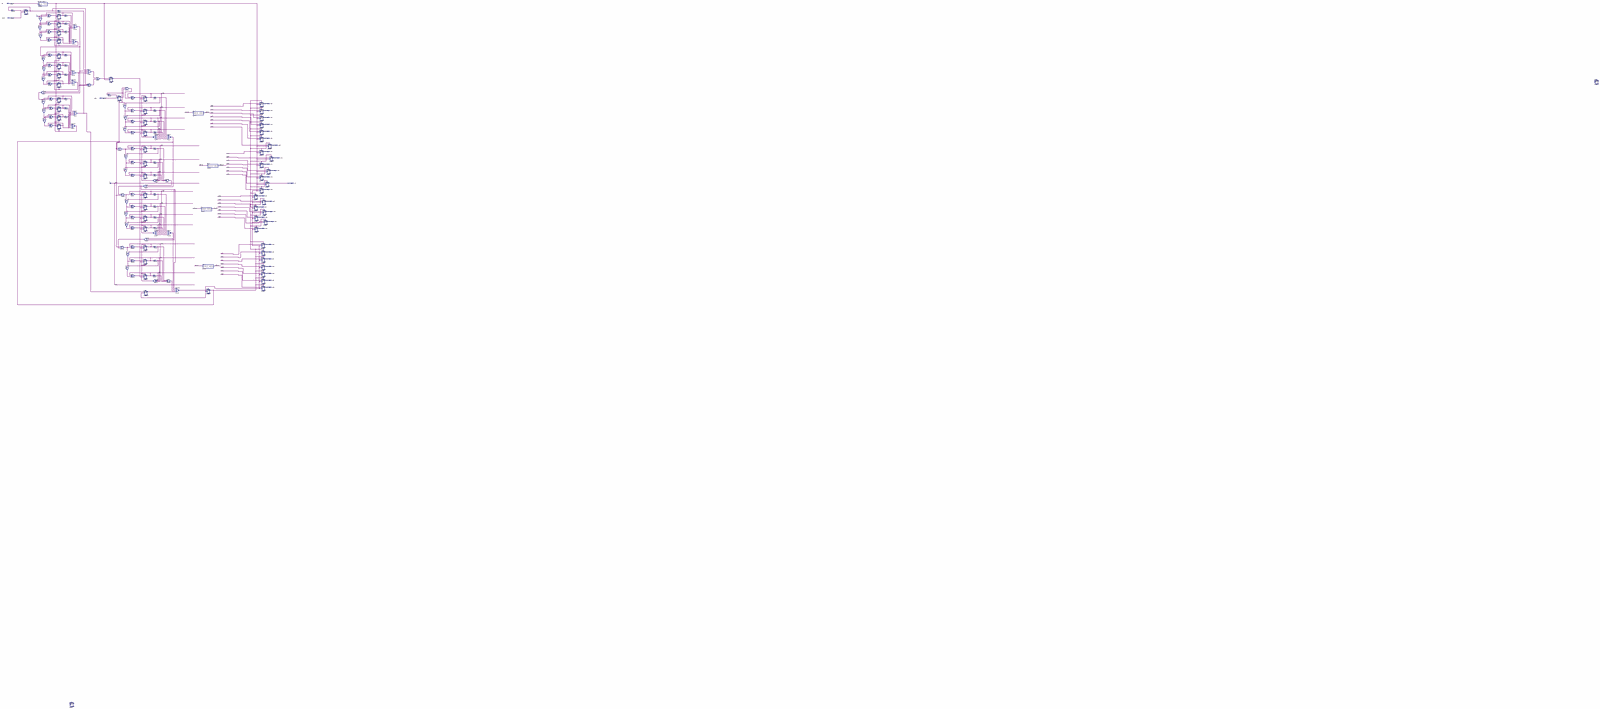
[diagram p0: schematic sheet, whole]
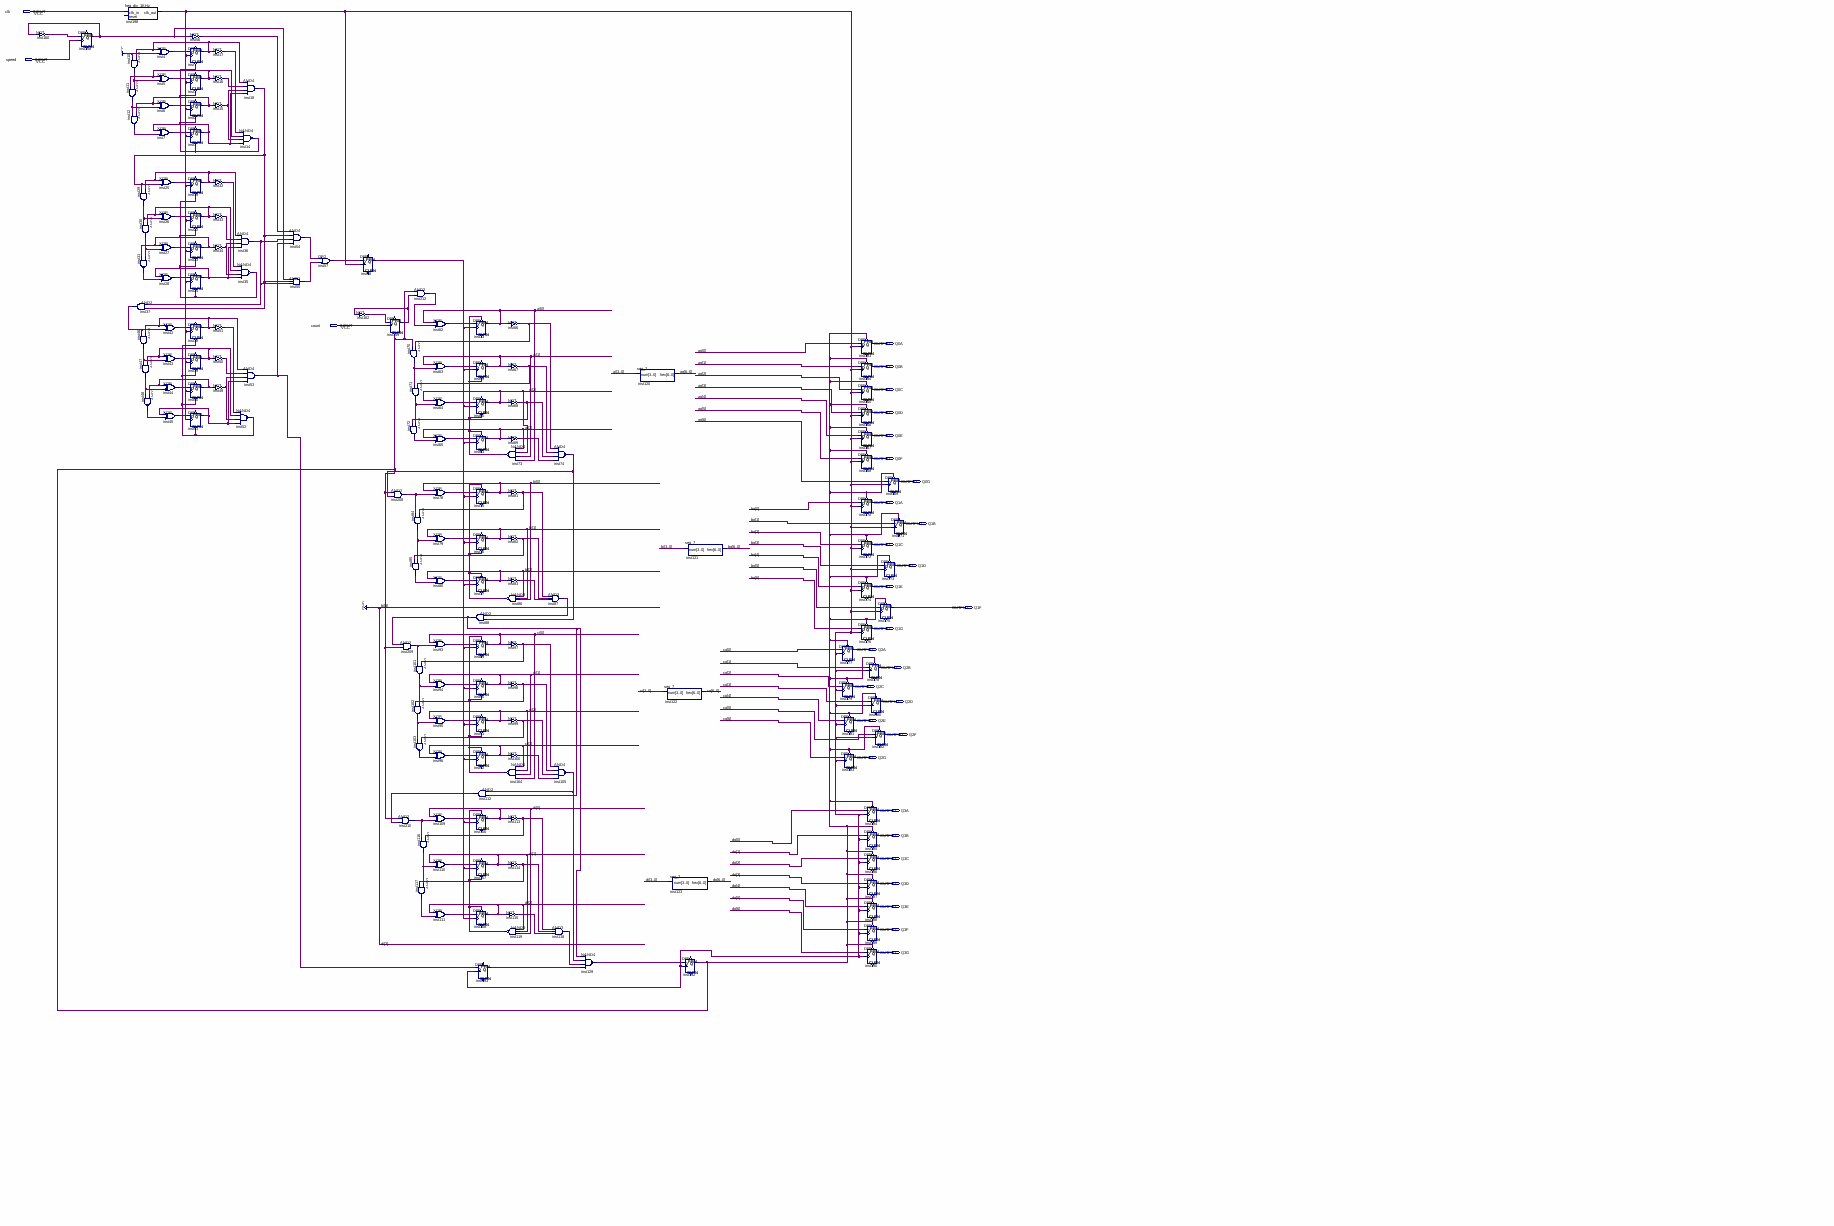
[diagram p1: schematic sheet, upper left part]
// Quartus schematic midterm.bdf as structural Verilog: 162 symbols, 31 pins
module midterm (
  input  clk,
  input  speed,
  input  count,
  output Q0A,
  output Q0B,
  output Q0C,
  output Q0D,
  output Q0E,
  output Q0F,
  output Q0G,
  output Q1A,
  output Q1B,
  output Q1C,
  output Q1D,
  output Q1E,
  output Q1F,
  output Q1G,
  output Q2A,
  output Q2B,
  output Q2C,
  output Q2D,
  output Q2E,
  output Q2F,
  output Q2G,
  output Q3A,
  output Q3B,
  output Q3C,
  output Q3D,
  output Q3E,
  output Q3F,
  output Q3G
);

  wire inst1_q, inst2_q, inst3_q, inst4_out, inst5_out, inst6_out, inst7_out, inst10_out, inst11_out,
       inst12_out, inst14_out, inst15_out, inst16_out, inst17_out, inst18_out, inst19_q, inst22_q, inst23_q,
       inst24_q, inst25_out, inst26_out, inst27_out, inst28_out, inst29_out, inst30_out, inst31_out,
       inst32_out, inst33_out, inst34_out, inst35_out, inst36_out, inst37_out, inst38_q, inst39_q, inst40_q,
       inst41_q, inst42_out, inst43_out, inst44_out, inst45_out, inst46_out, inst47_out, inst48_out,
       inst49_out, inst50_out, inst51_out, inst52_out, inst53_out, inst54_out, inst55_out, inst56_out,
       inst57_out, inst58_q, inst62_out, inst63_out, inst64_out, inst65_out, inst66_out, inst67_out,
       inst68_out, inst69_out, inst70_out, inst71_out, inst72_out, inst73_out, inst74_out, inst78_out,
       inst79_out, inst80_out, inst81_out, inst82_out, inst83_out, inst84_out, inst85_out, inst86_out,
       inst87_out, inst88_out, inst93_out, inst94_out, inst95_out, inst96_out, inst97_out, inst98_out,
       inst99_out, inst100_out, inst101_out, inst102_out, inst103_out, inst104_out, inst105_out, inst109_out,
       inst110_out, inst111_out, inst112_out, inst113_out, inst114_out, inst115_out, inst116_out,
       inst117_out, inst118_out, inst119_out, inst129_out, inst158_q, inst159_q, inst160_out, inst162_out,
       inst192_q, inst193_q, inst198_clk_out, inst208_out, inst209_out, inst210_out, inst212_out, inst_q;
  wire [2:0] bi, di;
  wire [3:0] ai, ci;
  wire [6:0] ao, bo, co, \do ;

  not inst160 (inst160_out, inst158_q);
  DFF inst158 (.CLK(speed), .D(inst160_out), .Q(inst158_q));  // open: CLRN, PRN
  freq_div_1KHz inst198 (.clk_in(clk), .clk_out(inst198_clk_out));  // open: reset
  and inst10 (inst10_out, inst_q, 1'b1);
  and inst11 (inst11_out, inst10_out, inst1_q);
  and inst12 (inst12_out, inst2_q, inst11_out);
  and inst29 (inst29_out, inst19_q, inst18_out);
  and inst31 (inst31_out, inst30_out, inst23_q);
  and inst37 (inst37_out, inst36_out, inst18_out);
  and inst46 (inst46_out, inst38_q, inst37_out);
  and inst30 (inst30_out, inst22_q, inst29_out);
  and inst47 (inst47_out, inst39_q, inst46_out);
  and inst48 (inst48_out, inst40_q, inst47_out);
  xor inst4 (inst4_out, inst_q, 1'b1);
  xor inst5 (inst5_out, inst1_q, inst10_out);
  xor inst6 (inst6_out, inst2_q, inst11_out);
  xor inst7 (inst7_out, inst3_q, inst12_out);
  xor inst25 (inst25_out, inst19_q, inst18_out);
  xor inst26 (inst26_out, inst22_q, inst29_out);
  xor inst27 (inst27_out, inst23_q, inst30_out);
  xor inst28 (inst28_out, inst24_q, inst31_out);
  xor inst42 (inst42_out, inst38_q, inst37_out);
  xor inst43 (inst43_out, inst39_q, inst46_out);
  xor inst44 (inst44_out, inst40_q, inst47_out);
  xor inst45 (inst45_out, inst41_q, inst48_out);
  not inst56 (inst56_out, inst158_q);
  DFF inst (.CLRN(inst14_out), .CLK(inst198_clk_out), .D(inst4_out), .Q(inst_q));  // open: PRN
  DFF inst1 (.CLRN(inst14_out), .CLK(inst198_clk_out), .D(inst5_out), .Q(inst1_q));  // open: PRN
  DFF inst2 (.CLRN(inst14_out), .CLK(inst198_clk_out), .D(inst6_out), .Q(inst2_q));  // open: PRN
  DFF inst3 (.CLRN(inst14_out), .CLK(inst198_clk_out), .D(inst7_out), .Q(inst3_q));  // open: PRN
  DFF inst19 (.CLRN(inst35_out), .CLK(inst198_clk_out), .D(inst25_out), .Q(inst19_q));  // open: PRN
  DFF inst22 (.CLRN(inst35_out), .CLK(inst198_clk_out), .D(inst26_out), .Q(inst22_q));  // open: PRN
  DFF inst23 (.CLRN(inst35_out), .CLK(inst198_clk_out), .D(inst27_out), .Q(inst23_q));  // open: PRN
  DFF inst24 (.CLRN(inst35_out), .CLK(inst198_clk_out), .D(inst28_out), .Q(inst24_q));  // open: PRN
  DFF inst38 (.CLRN(inst52_out), .CLK(inst198_clk_out), .D(inst42_out), .Q(inst38_q));  // open: PRN
  DFF inst39 (.CLRN(inst52_out), .CLK(inst198_clk_out), .D(inst43_out), .Q(inst39_q));  // open: PRN
  DFF inst40 (.CLRN(inst52_out), .CLK(inst198_clk_out), .D(inst44_out), .Q(inst40_q));  // open: PRN
  DFF inst41 (.CLRN(inst52_out), .CLK(inst198_clk_out), .D(inst45_out), .Q(inst41_q));  // open: PRN
  not inst17 (inst17_out, inst_q);
  not inst16 (inst16_out, inst1_q);
  not inst15 (inst15_out, inst2_q);
  not inst32 (inst32_out, inst19_q);
  not inst33 (inst33_out, inst22_q);
  not inst34 (inst34_out, inst23_q);
  not inst51 (inst51_out, inst38_q);
  not inst50 (inst50_out, inst39_q);
  not inst49 (inst49_out, inst40_q);
  DFF inst20 ();  // open: CLRN, CLK, D, PRN, Q
  and inst18 (inst18_out, inst_q, inst16_out, inst15_out, inst3_q);
  nand inst14 (inst14_out, inst17_out, inst1_q, inst15_out, inst3_q);
  and inst36 (inst36_out, inst19_q, inst33_out, inst34_out, inst24_q);
  nand inst35 (inst35_out, inst32_out, inst22_q, inst34_out, inst24_q);
  and inst53 (inst53_out, inst38_q, inst50_out, inst49_out, inst41_q);
  nand inst52 (inst52_out, inst51_out, inst39_q, inst49_out, inst41_q);
  and inst54 (inst54_out, inst56_out, inst18_out, inst36_out, inst53_out);
  and inst55 (inst55_out, inst158_q, inst18_out, inst36_out);
  or inst57 (inst57_out, inst54_out, inst55_out);
  DFF inst58 (.CLK(inst198_clk_out), .D(inst57_out), .Q(inst58_q));  // open: CLRN, PRN
  not inst162 (inst162_out, inst159_q);
  DFF inst159 (.CLRN(inst192_q), .CLK(count), .D(inst162_out), .Q(inst159_q));  // open: PRN
  and inst208 (inst208_out, inst192_q, inst74_out);
  and inst210 (inst210_out, inst192_q, inst112_out);
  and inst212 (inst212_out, inst192_q, inst159_q);
  and inst70 (inst70_out, inst66_out, inst192_q);
  and inst71 (inst71_out, inst67_out, inst70_out);
  and inst72 (inst72_out, inst71_out, inst68_out);
  and inst84 (inst84_out, inst81_out, inst208_out);
  and inst85 (inst85_out, inst84_out, inst82_out);
  and inst209 (inst209_out, inst88_out, inst192_q);
  and inst101 (inst101_out, inst97_out, inst209_out);
  and inst102 (inst102_out, inst101_out, inst98_out);
  and inst103 (inst103_out, inst99_out, inst102_out);
  and inst116 (inst116_out, inst113_out, inst210_out);
  and inst117 (inst117_out, inst116_out, inst114_out);
  xor inst62 (inst62_out, ai[0], inst212_out);
  xor inst63 (inst63_out, ai[1], inst70_out);
  xor inst64 (inst64_out, ai[2], inst71_out);
  xor inst65 (inst65_out, ai[3], inst72_out);
  xor inst78 (inst78_out, bi[0], inst208_out);
  xor inst79 (inst79_out, bi[1], inst84_out);
  xor inst80 (inst80_out, bi[2], inst85_out);
  xor inst93 (inst93_out, ci[0], inst209_out);
  xor inst94 (inst94_out, ci[1], inst101_out);
  xor inst95 (inst95_out, ci[2], inst102_out);
  xor inst96 (inst96_out, ci[3], inst103_out);
  xor inst109 (inst109_out, di[0], inst210_out);
  xor inst110 (inst110_out, di[1], inst116_out);
  xor inst111 (inst111_out, di[2], inst117_out);
  DFF inst13 (.CLK(inst58_q), .D(inst62_out), .PRN(inst73_out), .Q(ai[0]));  // open: CLRN
  DFF inst59 (.CLRN(inst73_out), .CLK(inst58_q), .D(inst63_out), .Q(ai[1]));  // open: PRN
  DFF inst60 (.CLRN(inst73_out), .CLK(inst58_q), .D(inst64_out), .Q(ai[2]));  // open: PRN
  DFF inst61 (.CLK(inst58_q), .D(inst65_out), .PRN(inst73_out), .Q(ai[3]));  // open: CLRN
  DFF inst75 (.CLK(inst58_q), .D(inst78_out), .PRN(inst86_out), .Q(bi[0]));  // open: CLRN
  DFF inst76 (.CLRN(inst86_out), .CLK(inst58_q), .D(inst79_out), .Q(bi[1]));  // open: PRN
  DFF inst77 (.CLK(inst58_q), .D(inst80_out), .PRN(inst86_out), .Q(bi[2]));  // open: CLRN
  and inst88 (inst88_out, inst87_out, inst74_out);
  DFF inst89 (.CLK(inst58_q), .D(inst93_out), .PRN(inst104_out), .Q(ci[0]));  // open: CLRN
  DFF inst90 (.CLRN(inst104_out), .CLK(inst58_q), .D(inst94_out), .Q(ci[1]));  // open: PRN
  DFF inst91 (.CLRN(inst104_out), .CLK(inst58_q), .D(inst95_out), .Q(ci[2]));  // open: PRN
  DFF inst92 (.CLK(inst58_q), .D(inst96_out), .PRN(inst104_out), .Q(ci[3]));  // open: CLRN
  and inst112 (inst112_out, inst105_out, inst88_out);
  DFF inst106 (.CLK(inst58_q), .D(inst109_out), .PRN(inst119_out), .Q(di[0]));  // open: CLRN
  DFF inst107 (.CLRN(inst119_out), .CLK(inst58_q), .D(inst110_out), .Q(di[1]));  // open: PRN
  DFF inst108 (.CLK(inst58_q), .D(inst111_out), .PRN(inst119_out), .Q(di[2]));  // open: CLRN
  DFF inst193 (.CLK(inst198_clk_out), .D(inst53_out), .Q(inst193_q));  // open: CLRN, PRN
  nand inst73 (inst73_out, ai[3], ai[2], ai[1], ai[0]);
  nand inst86 (inst86_out, bi[2], bi[1], bi[0]);
  nand inst104 (inst104_out, ci[3], ci[2], ci[1], ci[0]);
  not inst115 (inst115_out, di[2]);
  nand inst119 (inst119_out, di[2], di[1], di[0]);
  not inst66 (inst66_out, ai[0]);
  not inst67 (inst67_out, ai[1]);
  not inst68 (inst68_out, ai[2]);
  not inst69 (inst69_out, ai[3]);
  not inst81 (inst81_out, bi[0]);
  not inst82 (inst82_out, bi[1]);
  not inst83 (inst83_out, bi[2]);
  not inst97 (inst97_out, ci[0]);
  not inst98 (inst98_out, ci[1]);
  not inst99 (inst99_out, ci[2]);
  not inst100 (inst100_out, ci[3]);
  not inst113 (inst113_out, di[0]);
  not inst114 (inst114_out, di[1]);
  and inst87 (inst87_out, inst81_out, inst82_out, inst83_out);
  and inst118 (inst118_out, inst113_out, inst114_out, inst115_out);
  and inst74 (inst74_out, inst66_out, inst67_out, inst68_out, inst69_out);
  and inst105 (inst105_out, inst97_out, inst98_out, inst99_out, inst100_out);
  nand inst129 (inst129_out, inst88_out, inst105_out, inst118_out, inst193_q);
  seg_7 inst120 (.num(ai), .hex(ao));
  seg_7 inst122 (.num(ci), .hex(co));
  seg_7 inst123 (.num({1'b0, di}), .hex(\do ));
  seg_7 inst121 (.num({1'b0, bi}), .hex(bo));
  DFF inst192 (.CLK(inst198_clk_out), .D(inst129_out), .Q(inst192_q));  // open: CLRN, PRN
  DFF inst177 (.CLK(inst198_clk_out), .D(co[0]), .PRN(inst192_q), .Q(Q2A));  // open: CLRN
  DFF inst179 (.CLK(inst198_clk_out), .D(co[2]), .PRN(inst192_q), .Q(Q2C));  // open: CLRN
  DFF inst181 (.CLK(inst198_clk_out), .D(co[4]), .PRN(inst192_q), .Q(Q2E));  // open: CLRN
  DFF inst183 (.CLK(inst198_clk_out), .D(co[6]), .PRN(inst192_q), .Q(Q2G));  // open: CLRN
  DFF inst163 (.CLK(inst198_clk_out), .D(ao[0]), .PRN(inst192_q), .Q(Q0A));  // open: CLRN
  DFF inst164 (.CLK(inst198_clk_out), .D(ao[1]), .PRN(inst192_q), .Q(Q0B));  // open: CLRN
  DFF inst165 (.CLK(inst198_clk_out), .D(ao[2]), .PRN(inst192_q), .Q(Q0C));  // open: CLRN
  DFF inst166 (.CLK(inst198_clk_out), .D(ao[3]), .PRN(inst192_q), .Q(Q0D));  // open: CLRN
  DFF inst167 (.CLK(inst198_clk_out), .D(ao[4]), .PRN(inst192_q), .Q(Q0E));  // open: CLRN
  DFF inst168 (.CLK(inst198_clk_out), .D(ao[5]), .PRN(inst192_q), .Q(Q0F));  // open: CLRN
  DFF inst170 (.CLK(inst198_clk_out), .D(bo[0]), .PRN(inst192_q), .Q(Q1A));  // open: CLRN
  DFF inst172 (.CLK(inst198_clk_out), .D(bo[2]), .PRN(inst192_q), .Q(Q1C));  // open: CLRN
  DFF inst174 (.CLK(inst198_clk_out), .D(bo[4]), .PRN(inst192_q), .Q(Q1E));  // open: CLRN
  DFF inst176 (.CLK(inst198_clk_out), .D(bo[6]), .PRN(inst192_q), .Q(Q1G));  // open: CLRN
  DFF inst178 (.CLK(inst198_clk_out), .D(co[1]), .PRN(inst192_q), .Q(Q2B));  // open: CLRN
  DFF inst180 (.CLK(inst198_clk_out), .D(co[3]), .PRN(inst192_q), .Q(Q2D));  // open: CLRN
  DFF inst182 (.CLK(inst198_clk_out), .D(co[5]), .PRN(inst192_q), .Q(Q2F));  // open: CLRN
  DFF inst184 (.CLK(inst198_clk_out), .D(\do [0]), .PRN(inst192_q), .Q(Q3A));  // open: CLRN
  DFF inst185 (.CLK(inst198_clk_out), .D(\do [1]), .PRN(inst192_q), .Q(Q3B));  // open: CLRN
  DFF inst186 (.CLK(inst198_clk_out), .D(\do [2]), .PRN(inst192_q), .Q(Q3C));  // open: CLRN
  DFF inst187 (.CLK(inst198_clk_out), .D(\do [3]), .PRN(inst192_q), .Q(Q3D));  // open: CLRN
  DFF inst188 (.CLK(inst198_clk_out), .D(\do [4]), .PRN(inst192_q), .Q(Q3E));  // open: CLRN
  DFF inst189 (.CLK(inst198_clk_out), .D(\do [5]), .PRN(inst192_q), .Q(Q3F));  // open: CLRN
  DFF inst190 (.CLK(inst198_clk_out), .D(\do [6]), .PRN(inst192_q), .Q(Q3G));  // open: CLRN
  DFF inst169 (.CLK(inst198_clk_out), .D(ao[6]), .PRN(inst192_q), .Q(Q0G));  // open: CLRN
  DFF inst173 (.CLK(inst198_clk_out), .D(bo[3]), .PRN(inst192_q), .Q(Q1D));  // open: CLRN
  DFF inst175 (.CLK(inst198_clk_out), .D(bo[5]), .PRN(inst192_q), .Q(Q1F));  // open: CLRN
  DFF inst171 (.CLK(inst198_clk_out), .D(bo[1]), .PRN(inst192_q), .Q(Q1B));  // open: CLRN
  DFF inst21 ();  // open: CLRN, CLK, D, PRN, Q
endmodule
